# Altium project KB-PCB-R02.PrjPcb (part 2 of 2)

## Sheet backlight_RGB.SchDoc: Backlight RGB
size 594 x 420 mm; SheetNumber: 3; SheetTotal: 4; DocSize: DINA2
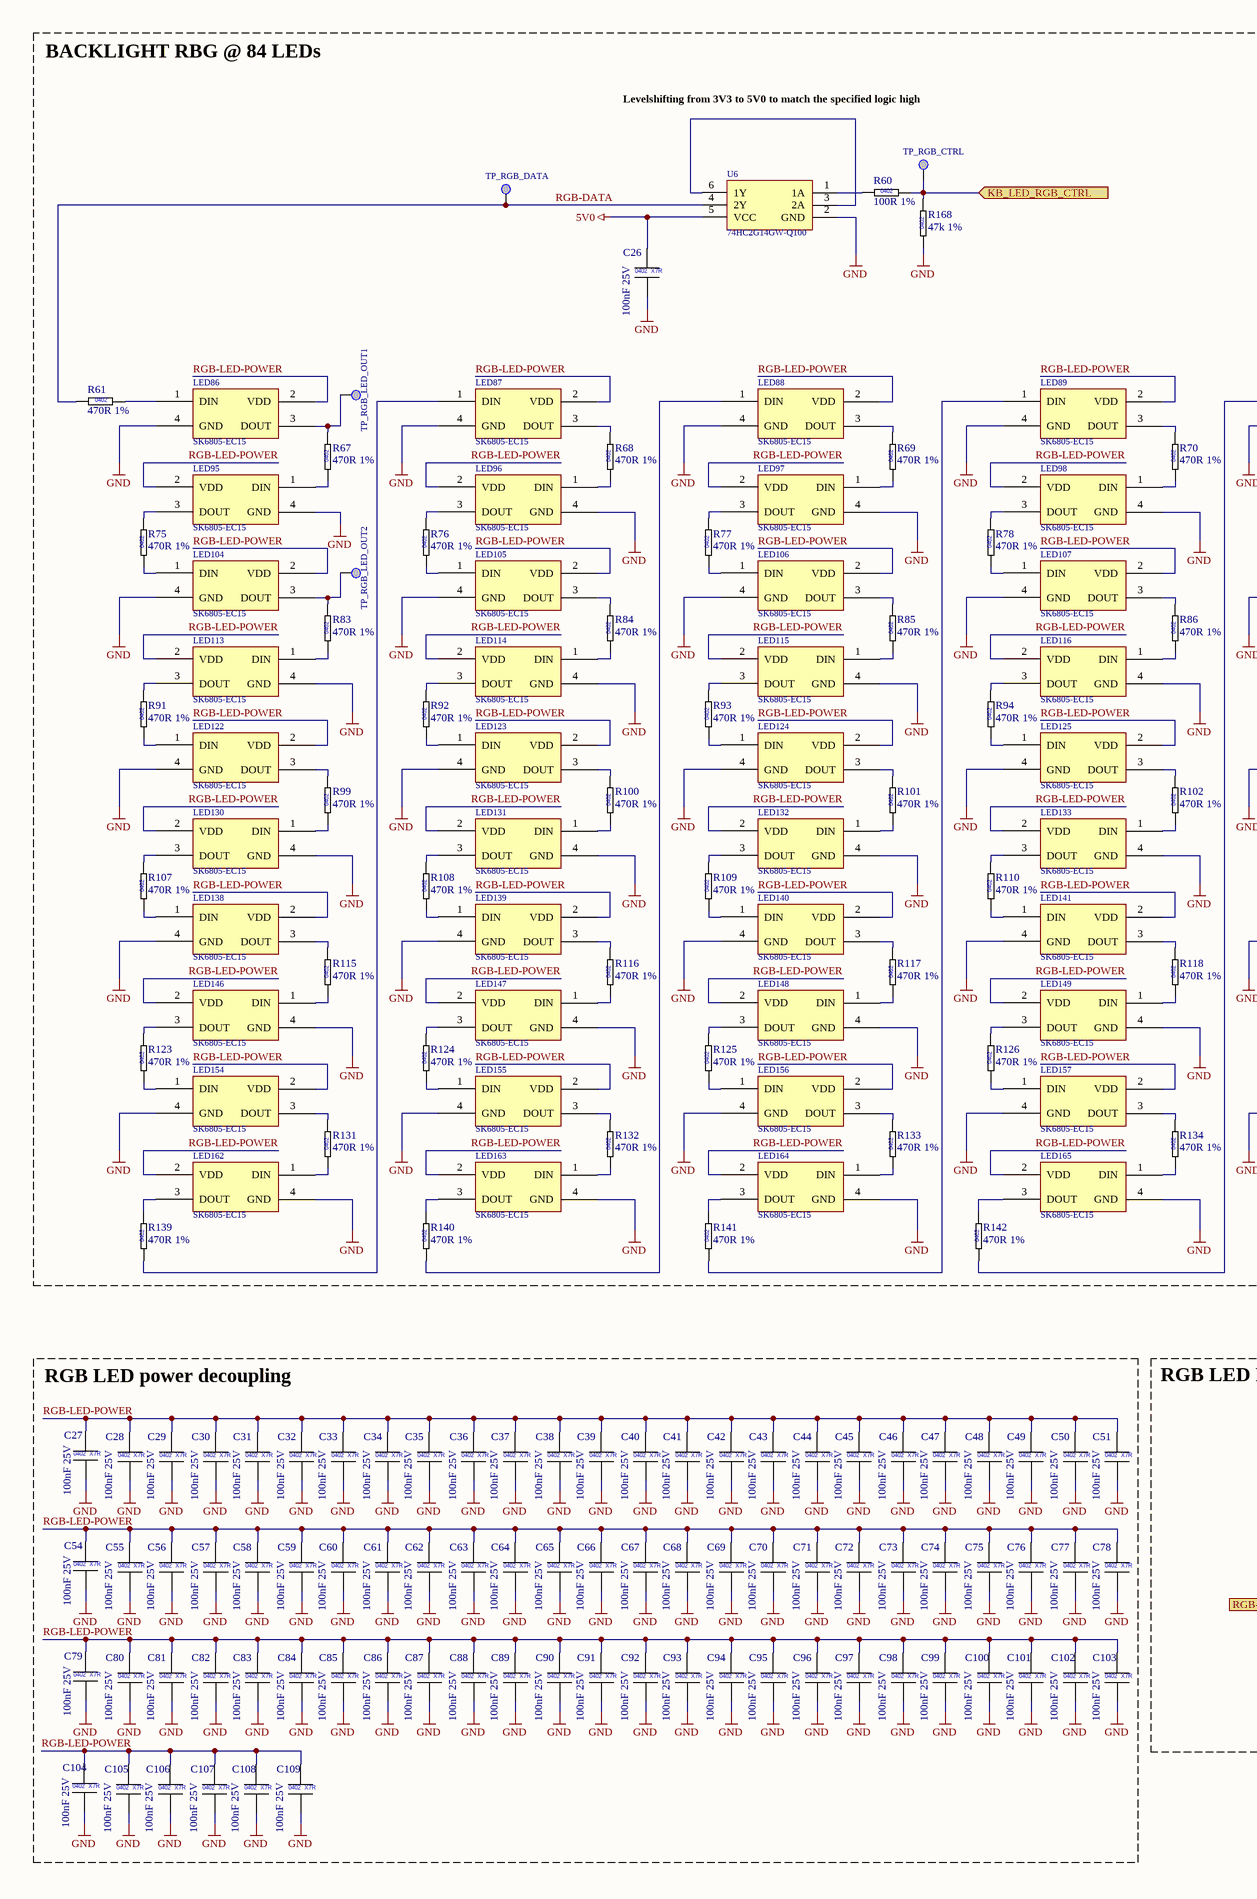
[diagram p5: backlight_RGB.SchDoc, left]
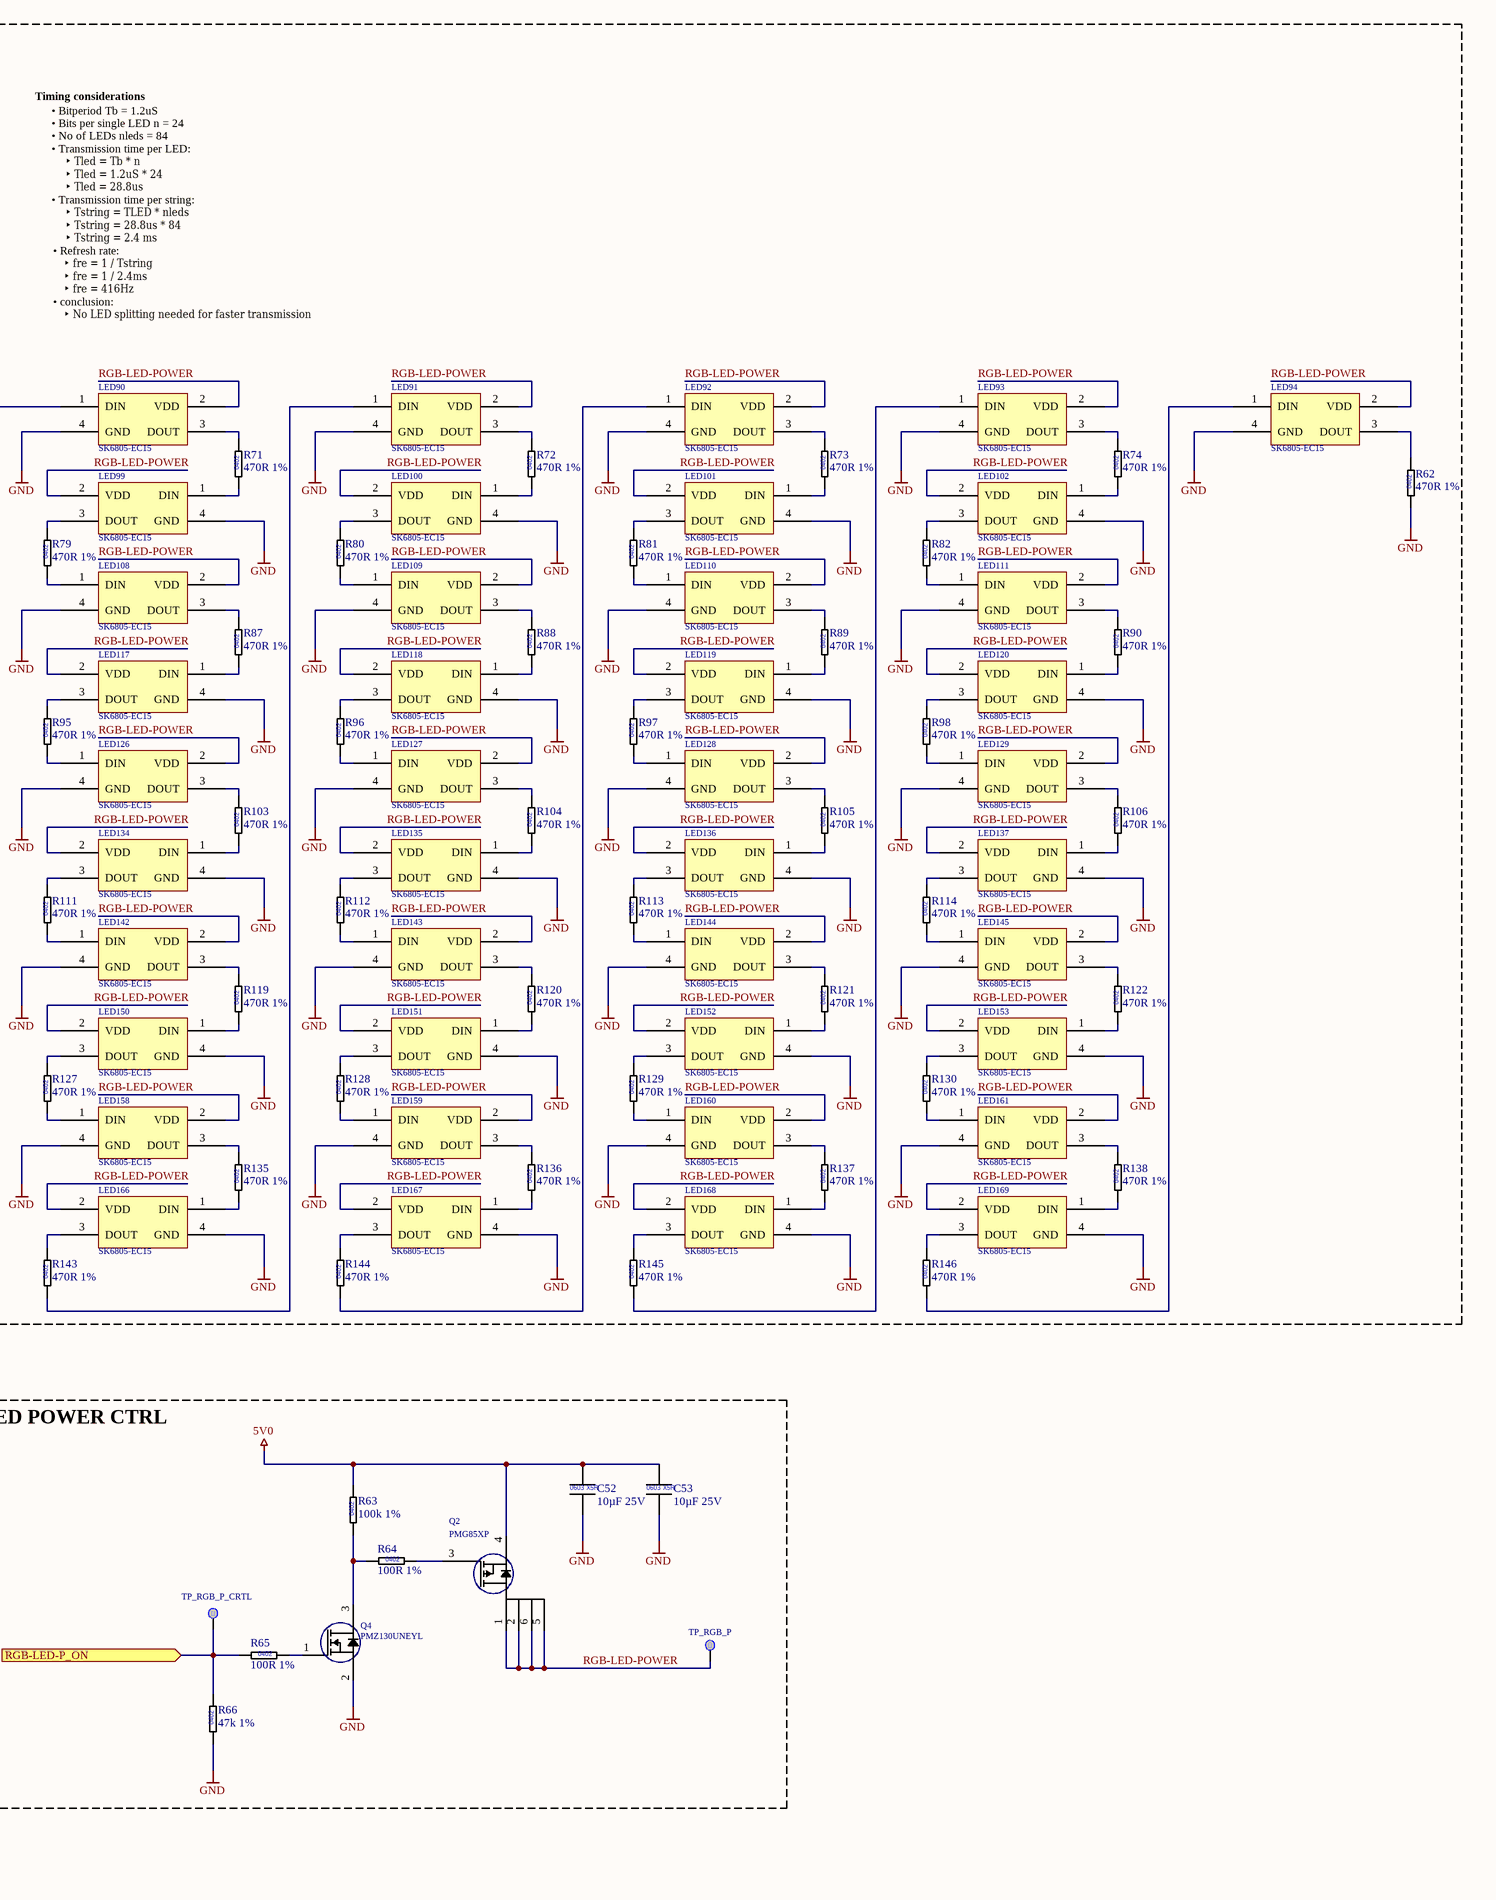
[diagram p6: backlight_RGB.SchDoc, right]

### Parts
(Parts that share a designator on the sheet are numbered #1, #2 ... from top to bottom, then left to right.)
?#3  (no value)  (graphical)
C26  100nF 25V  [CAPC1005X06L]
C27  100nF 25V  [CAPC1005X06L]
C28  100nF 25V  [CAPC1005X06L]
C29  100nF 25V  [CAPC1005X06L]
C30  100nF 25V  [CAPC1005X06L]
C31  100nF 25V  [CAPC1005X06L]
C32  100nF 25V  [CAPC1005X06L]
C33  100nF 25V  [CAPC1005X06L]
C34  100nF 25V  [CAPC1005X06L]
C35  100nF 25V  [CAPC1005X06L]
C36  100nF 25V  [CAPC1005X06L]
C37  100nF 25V  [CAPC1005X06L]
C38  100nF 25V  [CAPC1005X06L]
C39  100nF 25V  [CAPC1005X06L]
C40  100nF 25V  [CAPC1005X06L]
C41  100nF 25V  [CAPC1005X06L]
C42  100nF 25V  [CAPC1005X06L]
C43  100nF 25V  [CAPC1005X06L]
C44  100nF 25V  [CAPC1005X06L]
C45  100nF 25V  [CAPC1005X06L]
C46  100nF 25V  [CAPC1005X06L]
C47  100nF 25V  [CAPC1005X06L]
C48  100nF 25V  [CAPC1005X06L]
C49  100nF 25V  [CAPC1005X06L]
C50  100nF 25V  [CAPC1005X06L]
C51  100nF 25V  [CAPC1005X06L]
C52  10µF 25V  [CAPC1608X10L]
C53  10µF 25V  [CAPC1608X10L]
C54  100nF 25V  [CAPC1005X06L]
C55  100nF 25V  [CAPC1005X06L]
C56  100nF 25V  [CAPC1005X06L]
C57  100nF 25V  [CAPC1005X06L]
C58  100nF 25V  [CAPC1005X06L]
C59  100nF 25V  [CAPC1005X06L]
C60  100nF 25V  [CAPC1005X06L]
C61  100nF 25V  [CAPC1005X06L]
C62  100nF 25V  [CAPC1005X06L]
C63  100nF 25V  [CAPC1005X06L]
C64  100nF 25V  [CAPC1005X06L]
C65  100nF 25V  [CAPC1005X06L]
C66  100nF 25V  [CAPC1005X06L]
C67  100nF 25V  [CAPC1005X06L]
C68  100nF 25V  [CAPC1005X06L]
C69  100nF 25V  [CAPC1005X06L]
C70  100nF 25V  [CAPC1005X06L]
C71  100nF 25V  [CAPC1005X06L]
C72  100nF 25V  [CAPC1005X06L]
C73  100nF 25V  [CAPC1005X06L]
C74  100nF 25V  [CAPC1005X06L]
C75  100nF 25V  [CAPC1005X06L]
C76  100nF 25V  [CAPC1005X06L]
C77  100nF 25V  [CAPC1005X06L]
C78  100nF 25V  [CAPC1005X06L]
C79  100nF 25V  [CAPC1005X06L]
C80  100nF 25V  [CAPC1005X06L]
C81  100nF 25V  [CAPC1005X06L]
C82  100nF 25V  [CAPC1005X06L]
C83  100nF 25V  [CAPC1005X06L]
C84  100nF 25V  [CAPC1005X06L]
C85  100nF 25V  [CAPC1005X06L]
C86  100nF 25V  [CAPC1005X06L]
C87  100nF 25V  [CAPC1005X06L]
C88  100nF 25V  [CAPC1005X06L]
C89  100nF 25V  [CAPC1005X06L]
C90  100nF 25V  [CAPC1005X06L]
C91  100nF 25V  [CAPC1005X06L]
C92  100nF 25V  [CAPC1005X06L]
C93  100nF 25V  [CAPC1005X06L]
C94  100nF 25V  [CAPC1005X06L]
C95  100nF 25V  [CAPC1005X06L]
C96  100nF 25V  [CAPC1005X06L]
C97  100nF 25V  [CAPC1005X06L]
C98  100nF 25V  [CAPC1005X06L]
C99  100nF 25V  [CAPC1005X06L]
C100  100nF 25V  [CAPC1005X06L]
C101  100nF 25V  [CAPC1005X06L]
C102  100nF 25V  [CAPC1005X06L]
C103  100nF 25V  [CAPC1005X06L]
C104  100nF 25V  [CAPC1005X06L]
C105  100nF 25V  [CAPC1005X06L]
C106  100nF 25V  [CAPC1005X06L]
C107  100nF 25V  [CAPC1005X06L]
C108  100nF 25V  [CAPC1005X06L]
C109  100nF 25V  [CAPC1005X06L]
LED86  SK6805-EC15  [LED 0606 RGB SK6805-EC15]
LED87  SK6805-EC15  [LED 0606 RGB SK6805-EC15]
LED88  SK6805-EC15  [LED 0606 RGB SK6805-EC15]
LED89  SK6805-EC15  [LED 0606 RGB SK6805-EC15]
LED90  SK6805-EC15  [LED 0606 RGB SK6805-EC15]
LED91  SK6805-EC15  [LED 0606 RGB SK6805-EC15]
LED92  SK6805-EC15  [LED 0606 RGB SK6805-EC15]
LED93  SK6805-EC15  [LED 0606 RGB SK6805-EC15]
LED94  SK6805-EC15  [LED 0606 RGB SK6805-EC15]
LED95  SK6805-EC15  [LED 0606 RGB SK6805-EC15]
LED96  SK6805-EC15  [LED 0606 RGB SK6805-EC15]
LED97  SK6805-EC15  [LED 0606 RGB SK6805-EC15]
LED98  SK6805-EC15  [LED 0606 RGB SK6805-EC15]
LED99  SK6805-EC15  [LED 0606 RGB SK6805-EC15]
LED100  SK6805-EC15  [LED 0606 RGB SK6805-EC15]
LED101  SK6805-EC15  [LED 0606 RGB SK6805-EC15]
LED102  SK6805-EC15  [LED 0606 RGB SK6805-EC15]
LED104  SK6805-EC15  [LED 0606 RGB SK6805-EC15]
LED105  SK6805-EC15  [LED 0606 RGB SK6805-EC15]
LED106  SK6805-EC15  [LED 0606 RGB SK6805-EC15]
LED107  SK6805-EC15  [LED 0606 RGB SK6805-EC15]
LED108  SK6805-EC15  [LED 0606 RGB SK6805-EC15]
LED109  SK6805-EC15  [LED 0606 RGB SK6805-EC15]
LED110  SK6805-EC15  [LED 0606 RGB SK6805-EC15]
LED111  SK6805-EC15  [LED 0606 RGB SK6805-EC15]
LED113  SK6805-EC15  [LED 0606 RGB SK6805-EC15]
LED114  SK6805-EC15  [LED 0606 RGB SK6805-EC15]
LED115  SK6805-EC15  [LED 0606 RGB SK6805-EC15]
LED116  SK6805-EC15  [LED 0606 RGB SK6805-EC15]
LED117  SK6805-EC15  [LED 0606 RGB SK6805-EC15]
LED118  SK6805-EC15  [LED 0606 RGB SK6805-EC15]
LED119  SK6805-EC15  [LED 0606 RGB SK6805-EC15]
LED120  SK6805-EC15  [LED 0606 RGB SK6805-EC15]
LED122  SK6805-EC15  [LED 0606 RGB SK6805-EC15]
LED123  SK6805-EC15  [LED 0606 RGB SK6805-EC15]
LED124  SK6805-EC15  [LED 0606 RGB SK6805-EC15]
LED125  SK6805-EC15  [LED 0606 RGB SK6805-EC15]
LED126  SK6805-EC15  [LED 0606 RGB SK6805-EC15]
LED127  SK6805-EC15  [LED 0606 RGB SK6805-EC15]
LED128  SK6805-EC15  [LED 0606 RGB SK6805-EC15]
LED129  SK6805-EC15  [LED 0606 RGB SK6805-EC15]
LED130  SK6805-EC15  [LED 0606 RGB SK6805-EC15]
LED131  SK6805-EC15  [LED 0606 RGB SK6805-EC15]
LED132  SK6805-EC15  [LED 0606 RGB SK6805-EC15]
LED133  SK6805-EC15  [LED 0606 RGB SK6805-EC15]
LED134  SK6805-EC15  [LED 0606 RGB SK6805-EC15]
LED135  SK6805-EC15  [LED 0606 RGB SK6805-EC15]
LED136  SK6805-EC15  [LED 0606 RGB SK6805-EC15]
LED137  SK6805-EC15  [LED 0606 RGB SK6805-EC15]
LED138  SK6805-EC15  [LED 0606 RGB SK6805-EC15]
LED139  SK6805-EC15  [LED 0606 RGB SK6805-EC15]
LED140  SK6805-EC15  [LED 0606 RGB SK6805-EC15]
LED141  SK6805-EC15  [LED 0606 RGB SK6805-EC15]
LED142  SK6805-EC15  [LED 0606 RGB SK6805-EC15]
LED143  SK6805-EC15  [LED 0606 RGB SK6805-EC15]
LED144  SK6805-EC15  [LED 0606 RGB SK6805-EC15]
LED145  SK6805-EC15  [LED 0606 RGB SK6805-EC15]
LED146  SK6805-EC15  [LED 0606 RGB SK6805-EC15]
LED147  SK6805-EC15  [LED 0606 RGB SK6805-EC15]
LED148  SK6805-EC15  [LED 0606 RGB SK6805-EC15]
LED149  SK6805-EC15  [LED 0606 RGB SK6805-EC15]
LED150  SK6805-EC15  [LED 0606 RGB SK6805-EC15]
LED151  SK6805-EC15  [LED 0606 RGB SK6805-EC15]
LED152  SK6805-EC15  [LED 0606 RGB SK6805-EC15]
LED153  SK6805-EC15  [LED 0606 RGB SK6805-EC15]
LED154  SK6805-EC15  [LED 0606 RGB SK6805-EC15]
LED155  SK6805-EC15  [LED 0606 RGB SK6805-EC15]
LED156  SK6805-EC15  [LED 0606 RGB SK6805-EC15]
LED157  SK6805-EC15  [LED 0606 RGB SK6805-EC15]
LED158  SK6805-EC15  [LED 0606 RGB SK6805-EC15]
LED159  SK6805-EC15  [LED 0606 RGB SK6805-EC15]
LED160  SK6805-EC15  [LED 0606 RGB SK6805-EC15]
LED161  SK6805-EC15  [LED 0606 RGB SK6805-EC15]
LED162  SK6805-EC15  [LED 0606 RGB SK6805-EC15]
LED163  SK6805-EC15  [LED 0606 RGB SK6805-EC15]
LED164  SK6805-EC15  [LED 0606 RGB SK6805-EC15]
LED165  SK6805-EC15  [LED 0606 RGB SK6805-EC15]
LED166  SK6805-EC15  [LED 0606 RGB SK6805-EC15]
LED167  SK6805-EC15  [LED 0606 RGB SK6805-EC15]
LED168  SK6805-EC15  [LED 0606 RGB SK6805-EC15]
LED169  SK6805-EC15  [LED 0606 RGB SK6805-EC15]
Q2  PMG85XP  [TSOP65P210X110-6N]
Q4  PMZ130UNEYL  [DFN65P98X50-3N]
R60  100R 1%  [RESC1005X04L]
R61  470R 1%  [RESC1005X04L]
R62  470R 1%  [RESC1005X04L]
R63  100k 1%  [RESC1005X04L]
R64  100R 1%  [RESC1005X04L]
R65  100R 1%  [RESC1005X04L]
R66  47k 1%  [RESC1005X04L]
R67  470R 1%  [RESC1005X04L]
R68  470R 1%  [RESC1005X04L]
R69  470R 1%  [RESC1005X04L]
R70  470R 1%  [RESC1005X04L]
R71  470R 1%  [RESC1005X04L]
R72  470R 1%  [RESC1005X04L]
R73  470R 1%  [RESC1005X04L]
R74  470R 1%  [RESC1005X04L]
R75  470R 1%  [RESC1005X04L]
R76  470R 1%  [RESC1005X04L]
R77  470R 1%  [RESC1005X04L]
R78  470R 1%  [RESC1005X04L]
R79  470R 1%  [RESC1005X04L]
R80  470R 1%  [RESC1005X04L]
R81  470R 1%  [RESC1005X04L]
R82  470R 1%  [RESC1005X04L]
R83  470R 1%  [RESC1005X04L]
R84  470R 1%  [RESC1005X04L]
R85  470R 1%  [RESC1005X04L]
R86  470R 1%  [RESC1005X04L]
R87  470R 1%  [RESC1005X04L]
R88  470R 1%  [RESC1005X04L]
R89  470R 1%  [RESC1005X04L]
R90  470R 1%  [RESC1005X04L]
R91  470R 1%  [RESC1005X04L]
R92  470R 1%  [RESC1005X04L]
R93  470R 1%  [RESC1005X04L]
R94  470R 1%  [RESC1005X04L]
R95  470R 1%  [RESC1005X04L]
R96  470R 1%  [RESC1005X04L]
R97  470R 1%  [RESC1005X04L]
R98  470R 1%  [RESC1005X04L]
R99  470R 1%  [RESC1005X04L]
R100  470R 1%  [RESC1005X04L]
R101  470R 1%  [RESC1005X04L]
R102  470R 1%  [RESC1005X04L]
R103  470R 1%  [RESC1005X04L]
R104  470R 1%  [RESC1005X04L]
R105  470R 1%  [RESC1005X04L]
R106  470R 1%  [RESC1005X04L]
R107  470R 1%  [RESC1005X04L]
R108  470R 1%  [RESC1005X04L]
R109  470R 1%  [RESC1005X04L]
R110  470R 1%  [RESC1005X04L]
R111  470R 1%  [RESC1005X04L]
R112  470R 1%  [RESC1005X04L]
R113  470R 1%  [RESC1005X04L]
R114  470R 1%  [RESC1005X04L]
R115  470R 1%  [RESC1005X04L]
R116  470R 1%  [RESC1005X04L]
R117  470R 1%  [RESC1005X04L]
R118  470R 1%  [RESC1005X04L]
R119  470R 1%  [RESC1005X04L]
R120  470R 1%  [RESC1005X04L]
R121  470R 1%  [RESC1005X04L]
R122  470R 1%  [RESC1005X04L]
R123  470R 1%  [RESC1005X04L]
R124  470R 1%  [RESC1005X04L]
R125  470R 1%  [RESC1005X04L]
R126  470R 1%  [RESC1005X04L]
R127  470R 1%  [RESC1005X04L]
R128  470R 1%  [RESC1005X04L]
R129  470R 1%  [RESC1005X04L]
R130  470R 1%  [RESC1005X04L]
R131  470R 1%  [RESC1005X04L]
R132  470R 1%  [RESC1005X04L]
R133  470R 1%  [RESC1005X04L]
R134  470R 1%  [RESC1005X04L]
R135  470R 1%  [RESC1005X04L]
R136  470R 1%  [RESC1005X04L]
R137  470R 1%  [RESC1005X04L]
R138  470R 1%  [RESC1005X04L]
R139  470R 1%  [RESC1005X04L]
R140  470R 1%  [RESC1005X04L]
R141  470R 1%  [RESC1005X04L]
R142  470R 1%  [RESC1005X04L]
R143  470R 1%  [RESC1005X04L]
R144  470R 1%  [RESC1005X04L]
R145  470R 1%  [RESC1005X04L]
R146  470R 1%  [RESC1005X04L]
R168  47k 1%  [RESC1005X04L]
TP_RGB_CTRL  Testpoint 0.5mm  [TP_0.50mm]  (value not drawn)  (no BOM)
TP_RGB_DATA  Testpoint 0.75mm  [TP_0.75mm]  (value not drawn)  (no BOM)
TP_RGB_LED_OUT1  Testpoint 0.5mm  [TP_0.50mm]  (value not drawn)  (no BOM)
TP_RGB_LED_OUT2  Testpoint 0.5mm  [TP_0.50mm]  (value not drawn)  (no BOM)
TP_RGB_P  Testpoint 0.75mm  [TP_0.75mm]  (value not drawn)  (no BOM)
TP_RGB_P_CRTL  Testpoint 0.75mm  [TP_0.75mm]  (value not drawn)  (no BOM)
U6  74HC2G14GW-Q100  [TSOP65P210X110-6N]

### Blocks framed on the sheet
BACKLIGHT RBG @ 84 LEDs: C26 LED86-LED102 LED104-LED111 LED113-LED120 LED122-LED169 R60-R62 R67-R146 R168 TP_RGB_CTRL TP_RGB_DATA TP_RGB_LED_OUT1 TP_RGB_LED_OUT2 U6
RGB LED power decoupling: C27-C51 C54-C109
RGB LED POWER CTRL: C52 C53 Q2 Q4 R63-R66 TP_RGB_P TP_RGB_P_CRTL

### Ports
KB_LED_RGB_CTRL (in), RGB-LED-P_ON (in)

### Nets
5V0: C26.1 C52.1 C53.1 Q2.4(S) R63.2 U6.5(VCC)
GND: C26.2 C27.2 C28.2 C29.2 C30.2 C31.2 C32.2 C33.2 C34.2 C35.2 C36.2 C37.2 C38.2 C39.2 C40.2 C41.2 C42.2 C43.2 C44.2 C45.2 C46.2 C47.2 C48.2 C49.2 C50.2 C51.2 C52.2 C53.2 C54.2 C55.2 C56.2 C57.2 C58.2 C59.2 C60.2 C61.2 C62.2 C63.2 C64.2 C65.2 C66.2 C67.2 C68.2 C69.2 C70.2 C71.2 C72.2 C73.2 C74.2 C75.2 C76.2 C77.2 C78.2 C79.2 C80.2 C81.2 C82.2 C83.2 C84.2 C85.2 C86.2 C87.2 C88.2 C89.2 C90.2 C91.2 C92.2 C93.2 C94.2 C95.2 C96.2 C97.2 C98.2 C99.2 C100.2 C101.2 C102.2 C103.2 C104.2 C105.2 C106.2 C107.2 C108.2 C109.2 LED86.4(GND) LED87.4(GND) LED88.4(GND) LED89.4(GND) LED90.4(GND) LED91.4(GND) LED92.4(GND) LED93.4(GND) LED94.4(GND) LED95.4(GND) LED96.4(GND) LED97.4(GND) LED98.4(GND) LED99.4(GND) LED100.4(GND) LED101.4(GND) LED102.4(GND) LED104.4(GND) LED105.4(GND) LED106.4(GND) LED107.4(GND) LED108.4(GND) LED109.4(GND) LED110.4(GND) LED111.4(GND) LED113.4(GND) LED114.4(GND) LED115.4(GND) LED116.4(GND) LED117.4(GND) LED118.4(GND) LED119.4(GND) LED120.4(GND) LED122.4(GND) LED123.4(GND) LED124.4(GND) LED125.4(GND) LED126.4(GND) LED127.4(GND) LED128.4(GND) LED129.4(GND) LED130.4(GND) LED131.4(GND) LED132.4(GND) LED133.4(GND) LED134.4(GND) LED135.4(GND) LED136.4(GND) LED137.4(GND) LED138.4(GND) LED139.4(GND) LED140.4(GND) LED141.4(GND) LED142.4(GND) LED143.4(GND) LED144.4(GND) LED145.4(GND) LED146.4(GND) LED147.4(GND) LED148.4(GND) LED149.4(GND) LED150.4(GND) LED151.4(GND) LED152.4(GND) LED153.4(GND) LED154.4(GND) LED155.4(GND) LED156.4(GND) LED157.4(GND) LED158.4(GND) LED159.4(GND) LED160.4(GND) LED161.4(GND) LED162.4(GND) LED163.4(GND) LED164.4(GND) LED165.4(GND) LED166.4(GND) LED167.4(GND) LED168.4(GND) LED169.4(GND) Q4.2(S) R62.1 R66.1 R168.1 U6.2(GND)
RGB-DATA: R61.1 TP_RGB_DATA.TP U6.4(2Y)
RGB-LED-POWER: C27.1 C28.1 C29.1 C30.1 C31.1 C32.1 C33.1 C34.1 C35.1 C36.1 C37.1 C38.1 C39.1 C40.1 C41.1 C42.1 C43.1 C44.1 C45.1 C46.1 C47.1 C48.1 C49.1 C50.1 C51.1 C54.1 C55.1 C56.1 C57.1 C58.1 C59.1 C60.1 C61.1 C62.1 C63.1 C64.1 C65.1 C66.1 C67.1 C68.1 C69.1 C70.1 C71.1 C72.1 C73.1 C74.1 C75.1 C76.1 C77.1 C78.1 C79.1 C80.1 C81.1 C82.1 C83.1 C84.1 C85.1 C86.1 C87.1 C88.1 C89.1 C90.1 C91.1 C92.1 C93.1 C94.1 C95.1 C96.1 C97.1 C98.1 C99.1 C100.1 C101.1 C102.1 C103.1 C104.1 C105.1 C106.1 C107.1 C108.1 C109.1 LED86.2(VDD) LED87.2(VDD) LED88.2(VDD) LED89.2(VDD) LED90.2(VDD) LED91.2(VDD) LED92.2(VDD) LED93.2(VDD) LED94.2(VDD) LED95.2(VDD) LED96.2(VDD) LED97.2(VDD) LED98.2(VDD) LED99.2(VDD) LED100.2(VDD) LED101.2(VDD) LED102.2(VDD) LED104.2(VDD) LED105.2(VDD) LED106.2(VDD) LED107.2(VDD) LED108.2(VDD) LED109.2(VDD) LED110.2(VDD) LED111.2(VDD) LED113.2(VDD) LED114.2(VDD) LED115.2(VDD) LED116.2(VDD) LED117.2(VDD) LED118.2(VDD) LED119.2(VDD) LED120.2(VDD) LED122.2(VDD) LED123.2(VDD) LED124.2(VDD) LED125.2(VDD) LED126.2(VDD) LED127.2(VDD) LED128.2(VDD) LED129.2(VDD) LED130.2(VDD) LED131.2(VDD) LED132.2(VDD) LED133.2(VDD) LED134.2(VDD) LED135.2(VDD) LED136.2(VDD) LED137.2(VDD) LED138.2(VDD) LED139.2(VDD) LED140.2(VDD) LED141.2(VDD) LED142.2(VDD) LED143.2(VDD) LED144.2(VDD) LED145.2(VDD) LED146.2(VDD) LED147.2(VDD) LED148.2(VDD) LED149.2(VDD) LED150.2(VDD) LED151.2(VDD) LED152.2(VDD) LED153.2(VDD) LED154.2(VDD) LED155.2(VDD) LED156.2(VDD) LED157.2(VDD) LED158.2(VDD) LED159.2(VDD) LED160.2(VDD) LED161.2(VDD) LED162.2(VDD) LED163.2(VDD) LED164.2(VDD) LED165.2(VDD) LED166.2(VDD) LED167.2(VDD) LED168.2(VDD) LED169.2(VDD) Q2.1(D) Q2.2(D) Q2.5(D) Q2.6(D) TP_RGB_P.TP
NetLED86_1: LED86.1(DIN) R61.2
NetLED86_3: LED86.3(DOUT) R67.2 TP_RGB_LED_OUT1.TP
NetLED87_1: LED87.1(DIN) R139.1
NetLED87_3: LED87.3(DOUT) R68.2
NetLED88_1: LED88.1(DIN) R140.1
NetLED88_3: LED88.3(DOUT) R69.2
NetLED89_1: LED89.1(DIN) R141.1
NetLED89_3: LED89.3(DOUT) R70.2
NetLED90_1: LED90.1(DIN) R142.1
NetLED90_3: LED90.3(DOUT) R71.2
NetLED91_1: LED91.1(DIN) R143.1
NetLED91_3: LED91.3(DOUT) R72.2
NetLED92_1: LED92.1(DIN) R144.1
NetLED92_3: LED92.3(DOUT) R73.2
NetLED93_1: LED93.1(DIN) R145.1
NetLED93_3: LED93.3(DOUT) R74.2
NetLED94_1: LED94.1(DIN) R146.1
NetLED94_3: LED94.3(DOUT) R62.2
NetLED95_1: LED95.1(DIN) R67.1
NetLED95_3: LED95.3(DOUT) R75.2
NetLED96_1: LED96.1(DIN) R68.1
NetLED96_3: LED96.3(DOUT) R76.2
NetLED97_1: LED97.1(DIN) R69.1
NetLED97_3: LED97.3(DOUT) R77.2
NetLED98_1: LED98.1(DIN) R70.1
NetLED98_3: LED98.3(DOUT) R78.2
NetLED99_1: LED99.1(DIN) R71.1
NetLED99_3: LED99.3(DOUT) R79.2
NetLED100_1: LED100.1(DIN) R72.1
NetLED100_3: LED100.3(DOUT) R80.2
NetLED101_1: LED101.1(DIN) R73.1
NetLED101_3: LED101.3(DOUT) R81.2
NetLED102_1: LED102.1(DIN) R74.1
NetLED102_3: LED102.3(DOUT) R82.2
NetLED104_1: LED104.1(DIN) R75.1
NetLED104_3: LED104.3(DOUT) R83.2 TP_RGB_LED_OUT2.TP
NetLED105_1: LED105.1(DIN) R76.1
NetLED105_3: LED105.3(DOUT) R84.2
NetLED106_1: LED106.1(DIN) R77.1
NetLED106_3: LED106.3(DOUT) R85.2
NetLED107_1: LED107.1(DIN) R78.1
NetLED107_3: LED107.3(DOUT) R86.2
NetLED108_1: LED108.1(DIN) R79.1
NetLED108_3: LED108.3(DOUT) R87.2
NetLED109_1: LED109.1(DIN) R80.1
NetLED109_3: LED109.3(DOUT) R88.2
NetLED110_1: LED110.1(DIN) R81.1
NetLED110_3: LED110.3(DOUT) R89.2
NetLED111_1: LED111.1(DIN) R82.1
NetLED111_3: LED111.3(DOUT) R90.2
NetLED113_1: LED113.1(DIN) R83.1
NetLED113_3: LED113.3(DOUT) R91.2
NetLED114_1: LED114.1(DIN) R84.1
NetLED114_3: LED114.3(DOUT) R92.2
NetLED115_1: LED115.1(DIN) R85.1
NetLED115_3: LED115.3(DOUT) R93.2
NetLED116_1: LED116.1(DIN) R86.1
NetLED116_3: LED116.3(DOUT) R94.2
NetLED117_1: LED117.1(DIN) R87.1
NetLED117_3: LED117.3(DOUT) R95.2
NetLED118_1: LED118.1(DIN) R88.1
NetLED118_3: LED118.3(DOUT) R96.2
NetLED119_1: LED119.1(DIN) R89.1
NetLED119_3: LED119.3(DOUT) R97.2
NetLED120_1: LED120.1(DIN) R90.1
NetLED120_3: LED120.3(DOUT) R98.2
NetLED122_1: LED122.1(DIN) R91.1
NetLED122_3: LED122.3(DOUT) R99.2
NetLED123_1: LED123.1(DIN) R92.1
NetLED123_3: LED123.3(DOUT) R100.2
NetLED124_1: LED124.1(DIN) R93.1
NetLED124_3: LED124.3(DOUT) R101.2
NetLED125_1: LED125.1(DIN) R94.1
NetLED125_3: LED125.3(DOUT) R102.2
NetLED126_1: LED126.1(DIN) R95.1
NetLED126_3: LED126.3(DOUT) R103.2
NetLED127_1: LED127.1(DIN) R96.1
NetLED127_3: LED127.3(DOUT) R104.2
NetLED128_1: LED128.1(DIN) R97.1
NetLED128_3: LED128.3(DOUT) R105.2
NetLED129_1: LED129.1(DIN) R98.1
NetLED129_3: LED129.3(DOUT) R106.2
NetLED130_1: LED130.1(DIN) R99.1
NetLED130_3: LED130.3(DOUT) R107.2
NetLED131_1: LED131.1(DIN) R100.1
NetLED131_3: LED131.3(DOUT) R108.2
NetLED132_1: LED132.1(DIN) R101.1
NetLED132_3: LED132.3(DOUT) R109.2
NetLED133_1: LED133.1(DIN) R102.1
NetLED133_3: LED133.3(DOUT) R110.2
NetLED134_1: LED134.1(DIN) R103.1
NetLED134_3: LED134.3(DOUT) R111.2
NetLED135_1: LED135.1(DIN) R104.1
NetLED135_3: LED135.3(DOUT) R112.2
NetLED136_1: LED136.1(DIN) R105.1
NetLED136_3: LED136.3(DOUT) R113.2
NetLED137_1: LED137.1(DIN) R106.1
NetLED137_3: LED137.3(DOUT) R114.2
NetLED138_1: LED138.1(DIN) R107.1
NetLED138_3: LED138.3(DOUT) R115.2
NetLED139_1: LED139.1(DIN) R108.1
NetLED139_3: LED139.3(DOUT) R116.2
NetLED140_1: LED140.1(DIN) R109.1
NetLED140_3: LED140.3(DOUT) R117.2
NetLED141_1: LED141.1(DIN) R110.1
NetLED141_3: LED141.3(DOUT) R118.2
NetLED142_1: LED142.1(DIN) R111.1
NetLED142_3: LED142.3(DOUT) R119.2
NetLED143_1: LED143.1(DIN) R112.1
NetLED143_3: LED143.3(DOUT) R120.2
NetLED144_1: LED144.1(DIN) R113.1
NetLED144_3: LED144.3(DOUT) R121.2
NetLED145_1: LED145.1(DIN) R114.1
NetLED145_3: LED145.3(DOUT) R122.2
NetLED146_1: LED146.1(DIN) R115.1
NetLED146_3: LED146.3(DOUT) R123.2
NetLED147_1: LED147.1(DIN) R116.1
NetLED147_3: LED147.3(DOUT) R124.2
NetLED148_1: LED148.1(DIN) R117.1
NetLED148_3: LED148.3(DOUT) R125.2
NetLED149_1: LED149.1(DIN) R118.1
NetLED149_3: LED149.3(DOUT) R126.2
NetLED150_1: LED150.1(DIN) R119.1
NetLED150_3: LED150.3(DOUT) R127.2
NetLED151_1: LED151.1(DIN) R120.1
NetLED151_3: LED151.3(DOUT) R128.2
NetLED152_1: LED152.1(DIN) R121.1
NetLED152_3: LED152.3(DOUT) R129.2
NetLED153_1: LED153.1(DIN) R122.1
NetLED153_3: LED153.3(DOUT) R130.2
NetLED154_1: LED154.1(DIN) R123.1
NetLED154_3: LED154.3(DOUT) R131.2
NetLED155_1: LED155.1(DIN) R124.1
NetLED155_3: LED155.3(DOUT) R132.2
NetLED156_1: LED156.1(DIN) R125.1
NetLED156_3: LED156.3(DOUT) R133.2
NetLED157_1: LED157.1(DIN) R126.1
NetLED157_3: LED157.3(DOUT) R134.2
NetLED158_1: LED158.1(DIN) R127.1
NetLED158_3: LED158.3(DOUT) R135.2
NetLED159_1: LED159.1(DIN) R128.1
NetLED159_3: LED159.3(DOUT) R136.2
NetLED160_1: LED160.1(DIN) R129.1
NetLED160_3: LED160.3(DOUT) R137.2
NetLED161_1: LED161.1(DIN) R130.1
NetLED161_3: LED161.3(DOUT) R138.2
NetLED162_1: LED162.1(DIN) R131.1
NetLED162_3: LED162.3(DOUT) R139.2
NetLED163_1: LED163.1(DIN) R132.1
NetLED163_3: LED163.3(DOUT) R140.2
NetLED164_1: LED164.1(DIN) R133.1
NetLED164_3: LED164.3(DOUT) R141.2
NetLED165_1: LED165.1(DIN) R134.1
NetLED165_3: LED165.3(DOUT) R142.2
NetLED166_1: LED166.1(DIN) R135.1
NetLED166_3: LED166.3(DOUT) R143.2
NetLED167_1: LED167.1(DIN) R136.1
NetLED167_3: LED167.3(DOUT) R144.2
NetLED168_1: LED168.1(DIN) R137.1
NetLED168_3: LED168.3(DOUT) R145.2
NetLED169_1: LED169.1(DIN) R138.1
NetLED169_3: LED169.3(DOUT) R146.2
NetQ2_3: Q2.3(G) R64.2
NetQ4_1: Q4.1(G) R65.2
NetQ4_3: Q4.3(D) R63.1 R64.1
NetR60_1: R60.1 U6.1(1A)
NetR60_2: R60.2 R168.2 TP_RGB_CTRL.TP ; port KB_LED_RGB_CTRL
NetR65_1: R65.1 R66.2 TP_RGB_P_CRTL.TP ; port RGB-LED-P_ON
NetU6_3: U6.3(2A) U6.6(1Y)

### Notes on the sheet
- Levelshifting from 3V3 to 5V0 to match the specified logic high
- Timing considerations
- • Bitperiod Tb = 1.2uS
- • Bits per single LED n = 24
- • No of LEDs nleds = 84
- • Transmission time per LED:
- • Transmission time per string:
- ‣ Tled = Tb * n
- ‣ Tled = 1.2uS * 24
- ‣ Tled = 28.8us
- • Refresh rate:
- ‣ fre = 1 / Tstring
- ‣ Tstring = TLED * nleds
- ‣ Tstring = 28.8us * 84
- ‣ Tstring = 2.4 ms
- • conclusion:
- ‣ fre = 1 / 2.4ms
- ‣ fre = 416Hz
- ‣ No LED splitting needed for faster transmission
- © OV Tech GmbH - Open Visions Technology
- (in symbol CAP_0402_100nF_25V) 0402; X7R
- (in symbol CAP_0603_10µ_25V) 0603; X5R
- (in symbol RES_0402_47k_1%) 0402
- (in symbol RES_0402_100k_1%) 0402
- (in symbol RES_0402_100R_1%) 0402
- (in symbol RES_0402_470R_1%) 0402

### Library data of the parts
?#3 = Titleblock_01
C26-C51 C54-C109 = CAP_0402_100nF_25V: as C1 on sheet Input_MCU; Manufacturer 2: Taiyo Yuden
C52 C53 = CAP_0603_10µ_25V: Multilayer Ceramic Capacitors MLCC - SMD/SMT 0603 25VDC; Manufacturer 1: Murata Electronics; Manufacturer 1 Prt. Nr.: GRM188R61E106KA73J; Manufacturer 2 Prt. Nr.: CL10A106MA8NRNC; Manufacturer 2: Samsung Electro-Mechanics
LED86-LED102 LED104-LED111 LED113-LED120 LED122-LED169 = LED RGB SK6805-EC15: -40℃~+80℃ RGB 0606 Light Emitting Diodes (LED) ROHS; Manufacturer 1: OPSCO Optoelectronics; Manufacturer 1 Prt. Nr.: SK6805-EC15
Q2 = P-Channel MOSFET_PMG85XP: - 20 V, 2 A P-channel Trench MOSFET; Manufacturer 1: Nexperia; Manufacturer 1 Prt. Nr.: PMG85XP,115
Q4 = N-Channel MOSFET_PMZ130UNEYL: MOSFET PMZ130UNE/SOT883/XQFN3; Manufacturer 1: Nexperia; Manufacturer 1 Prt. Nr.: PMZ130UNEYL
R60 R64 R65 = RES_0402_100R_1%: Thick Film Resistors - SMD 100R 1%; Manufacturer 1: Vishay / Dale; Manufacturer 1 Prt. Nr.: CRCW0402100RFKEDC; Manufacturer 2 Prt. Nr.: RC0402FR-07100RL; Manufacturer 2: YAGEO
R61 R62 R67-R146 = RES_0402_470R_1%: Thick Film Resistors - SMD 470R 1%; Manufacturer 1: Vishay / Dale; Manufacturer 1 Prt. Nr.: CRCW0402470RFKED; Manufacturer 2 Prt. Nr.: RC0402FR-13470RL; Manufacturer 2: YAGEO
R63 = RES_0402_100k_1%: Thick Film Resistors - SMD 100k 1%; Manufacturer 1: Vishay / Dale; Manufacturer 1 Prt. Nr.: CRCW0402100KFKEDC; Manufacturer 2 Prt. Nr.: RC0402FR-07100KL; Manufacturer 2: YAGEO
R66 R168 = RES_0402_47k_1%: Thick Film Resistors - SMD 47k 1%; Manufacturer 1: Vishay / Dale; Manufacturer 1 Prt. Nr.: CRCW040247K0FKEDC; Manufacturer 2 Prt. Nr.: RT0402FRE0747KL; Manufacturer 2: YAGEO
U6 = Dual inverting Schmitt trigger 74HC2G14GW-Q100: Schmitt Trigger Inverter, 1I/P, 125Deg C Rohs Compliant: Yes |Nexperia 74HC2G14GW-Q100; Manufacturer 1: Nexperia; Manufacturer 1 Prt. Nr.: 74HC2G14GW-Q100

## Sheet backlight_W.SchDoc: Backlight W
size 594 x 420 mm; Author: T. Ludemann; SheetNumber: 4; SheetTotal: 4; DocSize: DINA2
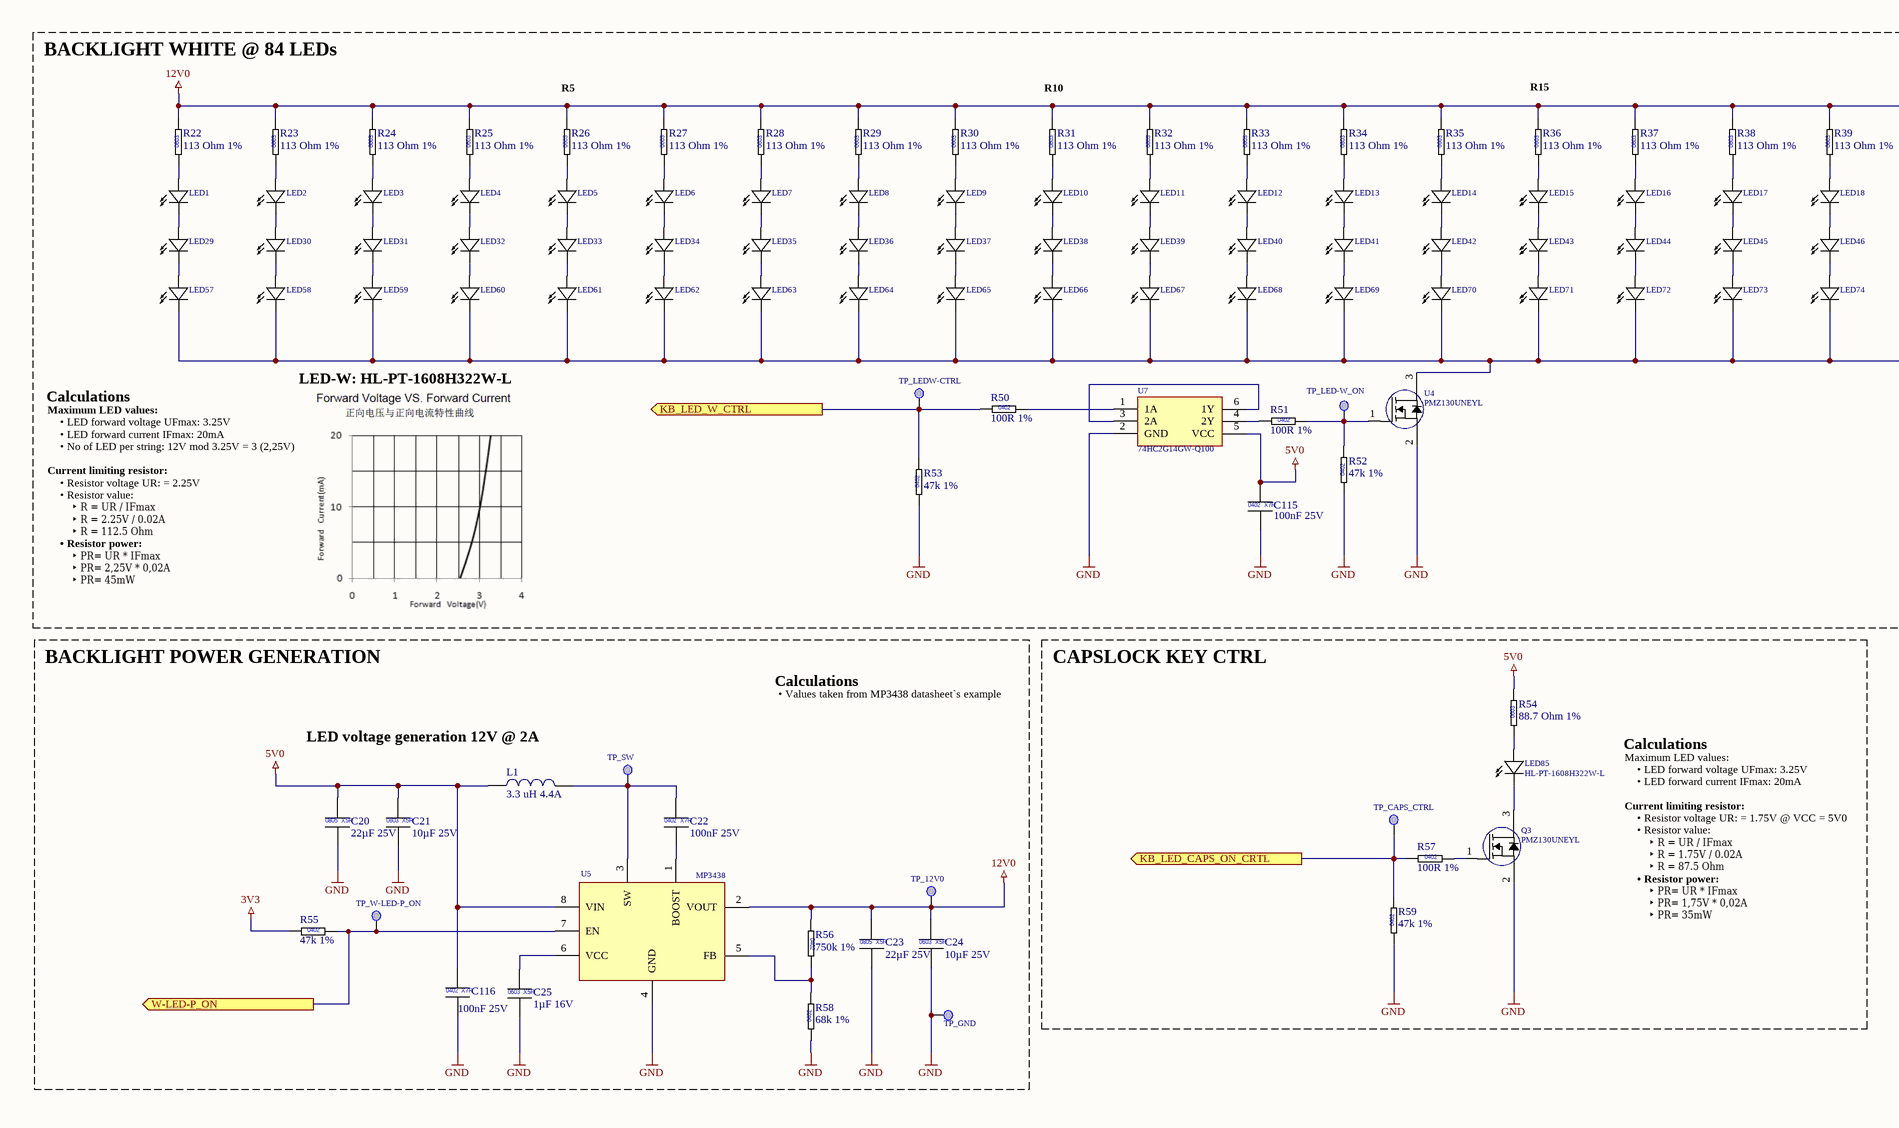
[diagram p7: backlight_W.SchDoc, left]
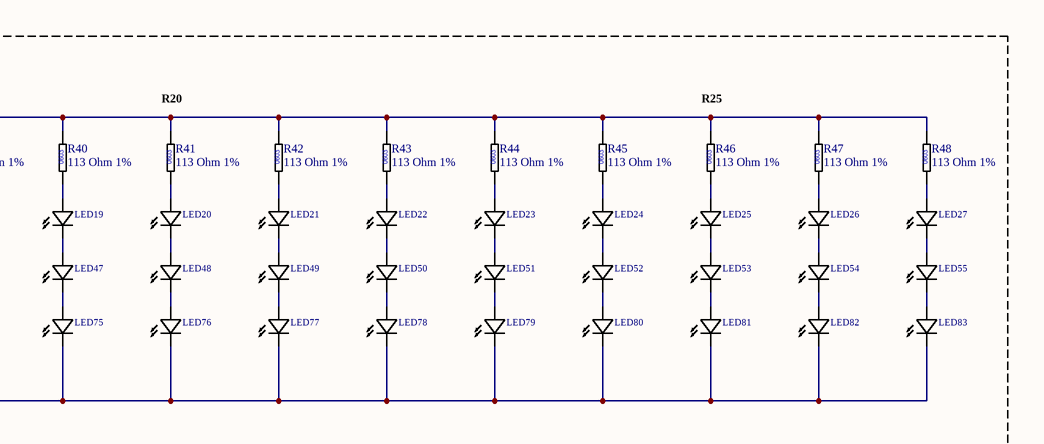
[diagram p8: backlight_W.SchDoc, right]

### Parts
(Parts that share a designator on the sheet are numbered #1, #2 ... from top to bottom, then left to right.)
?#4  (no value)  (graphical)
C20  22µF 25V  [CAPC2012X14L]
C21  10µF 25V  [CAPC1608X10L]
C22  100nF 25V  [CAPC1005X06L]
C23  22µF 25V  [CAPC2012X14L]
C24  10µF 25V  [CAPC1608X10L]
C25  1µF 16V  [CAPC1608X10L]
C115  100nF 25V  [CAPC1005X06L]
C116  100nF 25V  [CAPC1005X06L]
L1  3.3 uH 4.4A  [INDM4141X21N]
LED1  HL-PT-1608H322W-L  [LED 0603]  (value not drawn)
LED2  HL-PT-1608H322W-L  [LED 0603]  (value not drawn)
LED3  HL-PT-1608H322W-L  [LED 0603]  (value not drawn)
LED4  HL-PT-1608H322W-L  [LED 0603]  (value not drawn)
LED5  HL-PT-1608H322W-L  [LED 0603]  (value not drawn)
LED6  HL-PT-1608H322W-L  [LED 0603]  (value not drawn)
LED7  HL-PT-1608H322W-L  [LED 0603]  (value not drawn)
LED8  HL-PT-1608H322W-L  [LED 0603]  (value not drawn)
LED9  HL-PT-1608H322W-L  [LED 0603]  (value not drawn)
LED10  HL-PT-1608H322W-L  [LED 0603]  (value not drawn)
LED11  HL-PT-1608H322W-L  [LED 0603]  (value not drawn)
LED12  HL-PT-1608H322W-L  [LED 0603]  (value not drawn)
LED13  HL-PT-1608H322W-L  [LED 0603]  (value not drawn)
LED14  HL-PT-1608H322W-L  [LED 0603]  (value not drawn)
LED15  HL-PT-1608H322W-L  [LED 0603]  (value not drawn)
LED16  HL-PT-1608H322W-L  [LED 0603]  (value not drawn)
LED17  HL-PT-1608H322W-L  [LED 0603]  (value not drawn)
LED18  HL-PT-1608H322W-L  [LED 0603]  (value not drawn)
LED19  HL-PT-1608H322W-L  [LED 0603]  (value not drawn)
LED20  HL-PT-1608H322W-L  [LED 0603]  (value not drawn)
LED21  HL-PT-1608H322W-L  [LED 0603]  (value not drawn)
LED22  HL-PT-1608H322W-L  [LED 0603]  (value not drawn)
LED23  HL-PT-1608H322W-L  [LED 0603]  (value not drawn)
LED24  HL-PT-1608H322W-L  [LED 0603]  (value not drawn)
LED25  HL-PT-1608H322W-L  [LED 0603]  (value not drawn)
LED26  HL-PT-1608H322W-L  [LED 0603]  (value not drawn)
LED27  HL-PT-1608H322W-L  [LED 0603]  (value not drawn)
LED29  HL-PT-1608H322W-L  [LED 0603]  (value not drawn)
LED30  HL-PT-1608H322W-L  [LED 0603]  (value not drawn)
LED31  HL-PT-1608H322W-L  [LED 0603]  (value not drawn)
LED32  HL-PT-1608H322W-L  [LED 0603]  (value not drawn)
LED33  HL-PT-1608H322W-L  [LED 0603]  (value not drawn)
LED34  HL-PT-1608H322W-L  [LED 0603]  (value not drawn)
LED35  HL-PT-1608H322W-L  [LED 0603]  (value not drawn)
LED36  HL-PT-1608H322W-L  [LED 0603]  (value not drawn)
LED37  HL-PT-1608H322W-L  [LED 0603]  (value not drawn)
LED38  HL-PT-1608H322W-L  [LED 0603]  (value not drawn)
LED39  HL-PT-1608H322W-L  [LED 0603]  (value not drawn)
LED40  HL-PT-1608H322W-L  [LED 0603]  (value not drawn)
LED41  HL-PT-1608H322W-L  [LED 0603]  (value not drawn)
LED42  HL-PT-1608H322W-L  [LED 0603]  (value not drawn)
LED43  HL-PT-1608H322W-L  [LED 0603]  (value not drawn)
LED44  HL-PT-1608H322W-L  [LED 0603]  (value not drawn)
LED45  HL-PT-1608H322W-L  [LED 0603]  (value not drawn)
LED46  HL-PT-1608H322W-L  [LED 0603]  (value not drawn)
LED47  HL-PT-1608H322W-L  [LED 0603]  (value not drawn)
LED48  HL-PT-1608H322W-L  [LED 0603]  (value not drawn)
LED49  HL-PT-1608H322W-L  [LED 0603]  (value not drawn)
LED50  HL-PT-1608H322W-L  [LED 0603]  (value not drawn)
LED51  HL-PT-1608H322W-L  [LED 0603]  (value not drawn)
LED52  HL-PT-1608H322W-L  [LED 0603]  (value not drawn)
LED53  HL-PT-1608H322W-L  [LED 0603]  (value not drawn)
LED54  HL-PT-1608H322W-L  [LED 0603]  (value not drawn)
LED55  HL-PT-1608H322W-L  [LED 0603]  (value not drawn)
LED57  HL-PT-1608H322W-L  [LED 0603]  (value not drawn)
LED58  HL-PT-1608H322W-L  [LED 0603]  (value not drawn)
LED59  HL-PT-1608H322W-L  [LED 0603]  (value not drawn)
LED60  HL-PT-1608H322W-L  [LED 0603]  (value not drawn)
LED61  HL-PT-1608H322W-L  [LED 0603]  (value not drawn)
LED62  HL-PT-1608H322W-L  [LED 0603]  (value not drawn)
LED63  HL-PT-1608H322W-L  [LED 0603]  (value not drawn)
LED64  HL-PT-1608H322W-L  [LED 0603]  (value not drawn)
LED65  HL-PT-1608H322W-L  [LED 0603]  (value not drawn)
LED66  HL-PT-1608H322W-L  [LED 0603]  (value not drawn)
LED67  HL-PT-1608H322W-L  [LED 0603]  (value not drawn)
LED68  HL-PT-1608H322W-L  [LED 0603]  (value not drawn)
LED69  HL-PT-1608H322W-L  [LED 0603]  (value not drawn)
LED70  HL-PT-1608H322W-L  [LED 0603]  (value not drawn)
LED71  HL-PT-1608H322W-L  [LED 0603]  (value not drawn)
LED72  HL-PT-1608H322W-L  [LED 0603]  (value not drawn)
LED73  HL-PT-1608H322W-L  [LED 0603]  (value not drawn)
LED74  HL-PT-1608H322W-L  [LED 0603]  (value not drawn)
LED75  HL-PT-1608H322W-L  [LED 0603]  (value not drawn)
LED76  HL-PT-1608H322W-L  [LED 0603]  (value not drawn)
LED77  HL-PT-1608H322W-L  [LED 0603]  (value not drawn)
LED78  HL-PT-1608H322W-L  [LED 0603]  (value not drawn)
LED79  HL-PT-1608H322W-L  [LED 0603]  (value not drawn)
LED80  HL-PT-1608H322W-L  [LED 0603]  (value not drawn)
LED81  HL-PT-1608H322W-L  [LED 0603]  (value not drawn)
LED82  HL-PT-1608H322W-L  [LED 0603]  (value not drawn)
LED83  HL-PT-1608H322W-L  [LED 0603]  (value not drawn)
LED85  HL-PT-1608H322W-L  [LED 0603]
Q3  PMZ130UNEYL  [DFN65P98X50-3N]
R22  113 Ohm 1%  [RESC1608X04L]
R23  113 Ohm 1%  [RESC1608X04L]
R24  113 Ohm 1%  [RESC1608X04L]
R25  113 Ohm 1%  [RESC1608X04L]
R26  113 Ohm 1%  [RESC1608X04L]
R27  113 Ohm 1%  [RESC1608X04L]
R28  113 Ohm 1%  [RESC1608X04L]
R29  113 Ohm 1%  [RESC1608X04L]
R30  113 Ohm 1%  [RESC1608X04L]
R31  113 Ohm 1%  [RESC1608X04L]
R32  113 Ohm 1%  [RESC1608X04L]
R33  113 Ohm 1%  [RESC1608X04L]
R34  113 Ohm 1%  [RESC1608X04L]
R35  113 Ohm 1%  [RESC1608X04L]
R36  113 Ohm 1%  [RESC1608X04L]
R37  113 Ohm 1%  [RESC1608X04L]
R38  113 Ohm 1%  [RESC1608X04L]
R39  113 Ohm 1%  [RESC1608X04L]
R40  113 Ohm 1%  [RESC1608X04L]
R41  113 Ohm 1%  [RESC1608X04L]
R42  113 Ohm 1%  [RESC1608X04L]
R43  113 Ohm 1%  [RESC1608X04L]
R44  113 Ohm 1%  [RESC1608X04L]
R45  113 Ohm 1%  [RESC1608X04L]
R46  113 Ohm 1%  [RESC1608X04L]
R47  113 Ohm 1%  [RESC1608X04L]
R48  113 Ohm 1%  [RESC1608X04L]
R50  100R 1%  [RESC1005X04L]
R51  100R 1%  [RESC1005X04L]
R52  47k 1%  [RESC1005X04L]
R53  47k 1%  [RESC1005X04L]
R54  88.7 Ohm 1%  [RESC1608X04L]
R55  47k 1%  [RESC1005X04L]
R56  750k 1%  [RESC1005X04L]
R57  100R 1%  [RESC1005X04L]
R58  68k 1%  [RESC1005X04L]
R59  47k 1%  [RESC1005X04L]
TP_12V0  Testpoint 0.75mm  [TP_0.75mm]  (value not drawn)  (no BOM)
TP_CAPS_CTRL  Testpoint 0.75mm  [TP_0.75mm]  (value not drawn)  (no BOM)
TP_GND  Testpoint 0.75mm  [TP_0.75mm]  (value not drawn)  (no BOM)
TP_LED-W_ON  Testpoint 0.75mm  [TP_0.75mm]  (value not drawn)  (no BOM)
TP_LEDW-CTRL  Testpoint 0.75mm  [TP_0.75mm]  (value not drawn)  (no BOM)
TP_SW  Testpoint 0.75mm  [TP_0.75mm]  (value not drawn)  (no BOM)
TP_W-LED-P_ON  Testpoint 0.75mm  [TP_0.75mm]  (value not drawn)  (no BOM)
U4  PMZ130UNEYL  [DFN65P98X50-3N]
U5  MP3438  [SOT583]
U7  74HC2G14GW-Q100  [TSOP65P210X110-6N]

### Blocks framed on the sheet
BACKLIGHT WHITE @ 84 LEDs: C115 LED1-LED27 LED29-LED55 LED57-LED83 R22-R48 R50-R53 TP_LED-W_ON TP_LEDW-CTRL U4 U7
BACKLIGHT POWER GENERATION: C20-C25 C116 L1 R55 R56 R58 TP_12V0 TP_GND TP_SW TP_W-LED-P_ON U5
CAPSLOCK KEY CTRL: LED85 Q3 R54 R57 R59 TP_CAPS_CTRL

### Ports
KB_LED_CAPS_ON_CRTL (out), KB_LED_W_CTRL (out), W-LED-P_ON (out)

### Nets
3V3: R55.1
5V0: C20.1 C21.1 C115.1 C116.1 L1.1 R54.2 U5.8(VIN) U7.5(VCC)
12V0: C23.1 C24.1 R22.2 R23.2 R24.2 R25.2 R26.2 R27.2 R28.2 R29.2 R30.2 R31.2 R32.2 R33.2 R34.2 R35.2 R36.2 R37.2 R38.2 R39.2 R40.2 R41.2 R42.2 R43.2 R44.2 R45.2 R46.2 R47.2 R48.2 R56.1 TP_12V0.TP U5.2(VOUT)
GND: C20.2 C21.2 C23.2 C24.2 C25.2 C115.2 C116.2 Q3.2(S) R52.1 R53.1 R58.1 R59.1 TP_GND.TP U4.2(S) U5.4(GND) U7.2(GND)
NetC22_1: C22.1 L1.2 TP_SW.TP U5.3(SW)
NetC22_2: C22.2 U5.1(BOOST)
NetC25_1: C25.1 U5.6(VCC)
NetLED1_1: LED1.1 LED29.2
NetLED1_2: LED1.2 R22.1
NetLED2_1: LED2.1 LED30.2
NetLED2_2: LED2.2 R23.1
NetLED3_1: LED3.1 LED31.2
NetLED3_2: LED3.2 R24.1
NetLED4_1: LED4.1 LED32.2
NetLED4_2: LED4.2 R25.1
NetLED5_1: LED5.1 LED33.2
NetLED5_2: LED5.2 R26.1
NetLED6_1: LED6.1 LED34.2
NetLED6_2: LED6.2 R27.1
NetLED7_1: LED7.1 LED35.2
NetLED7_2: LED7.2 R28.1
NetLED8_1: LED8.1 LED36.2
NetLED8_2: LED8.2 R29.1
NetLED9_1: LED9.1 LED37.2
NetLED9_2: LED9.2 R30.1
NetLED10_1: LED10.1 LED38.2
NetLED10_2: LED10.2 R31.1
NetLED11_1: LED11.1 LED39.2
NetLED11_2: LED11.2 R32.1
NetLED12_1: LED12.1 LED40.2
NetLED12_2: LED12.2 R33.1
NetLED13_1: LED13.1 LED41.2
NetLED13_2: LED13.2 R34.1
NetLED14_1: LED14.1 LED42.2
NetLED14_2: LED14.2 R35.1
NetLED15_1: LED15.1 LED43.2
NetLED15_2: LED15.2 R36.1
NetLED16_1: LED16.1 LED44.2
NetLED16_2: LED16.2 R37.1
NetLED17_1: LED17.1 LED45.2
NetLED17_2: LED17.2 R38.1
NetLED18_1: LED18.1 LED46.2
NetLED18_2: LED18.2 R39.1
NetLED19_1: LED19.1 LED47.2
NetLED19_2: LED19.2 R40.1
NetLED20_1: LED20.1 LED48.2
NetLED20_2: LED20.2 R41.1
NetLED21_1: LED21.1 LED49.2
NetLED21_2: LED21.2 R42.1
NetLED22_1: LED22.1 LED50.2
NetLED22_2: LED22.2 R43.1
NetLED23_1: LED23.1 LED51.2
NetLED23_2: LED23.2 R44.1
NetLED24_1: LED24.1 LED52.2
NetLED24_2: LED24.2 R45.1
NetLED25_1: LED25.1 LED53.2
NetLED25_2: LED25.2 R46.1
NetLED26_1: LED26.1 LED54.2
NetLED26_2: LED26.2 R47.1
NetLED27_1: LED27.1 LED55.2
NetLED27_2: LED27.2 R48.1
NetLED29_1: LED29.1 LED57.2
NetLED30_1: LED30.1 LED58.2
NetLED31_1: LED31.1 LED59.2
NetLED32_1: LED32.1 LED60.2
NetLED33_1: LED33.1 LED61.2
NetLED34_1: LED34.1 LED62.2
NetLED35_1: LED35.1 LED63.2
NetLED36_1: LED36.1 LED64.2
NetLED37_1: LED37.1 LED65.2
NetLED38_1: LED38.1 LED66.2
NetLED39_1: LED39.1 LED67.2
NetLED40_1: LED40.1 LED68.2
NetLED41_1: LED41.1 LED69.2
NetLED42_1: LED42.1 LED70.2
NetLED43_1: LED43.1 LED71.2
NetLED44_1: LED44.1 LED72.2
NetLED45_1: LED45.1 LED73.2
NetLED46_1: LED46.1 LED74.2
NetLED47_1: LED47.1 LED75.2
NetLED48_1: LED48.1 LED76.2
NetLED49_1: LED49.1 LED77.2
NetLED50_1: LED50.1 LED78.2
NetLED51_1: LED51.1 LED79.2
NetLED52_1: LED52.1 LED80.2
NetLED53_1: LED53.1 LED81.2
NetLED54_1: LED54.1 LED82.2
NetLED55_1: LED55.1 LED83.2
NetLED57_1: LED57.1 LED58.1 LED59.1 LED60.1 LED61.1 LED62.1 LED63.1 LED64.1 LED65.1 LED66.1 LED67.1 LED68.1 LED69.1 LED70.1 LED71.1 LED72.1 LED73.1 LED74.1 LED75.1 LED76.1 LED77.1 LED78.1 LED79.1 LED80.1 LED81.1 LED82.1 LED83.1 U4.3(D)
NetLED85_1: LED85.1 Q3.3(D)
NetLED85_2: LED85.2 R54.1
NetQ3_1: Q3.1(G) R57.2
NetR50_1: R50.1 R53.2 TP_LEDW-CTRL.TP ; port KB_LED_W_CTRL
NetR50_2: R50.2 U7.1(1A)
NetR51_1: R51.1 U7.4(2Y)
NetR51_2: R51.2 R52.2 TP_LED-W_ON.TP U4.1(G)
NetR55_2: R55.2 TP_W-LED-P_ON.TP U5.7(EN) ; port W-LED-P_ON
NetR56_2: R56.2 R58.2 U5.5(FB)
NetR57_1: R57.1 R59.2 TP_CAPS_CTRL.TP ; port KB_LED_CAPS_ON_CRTL
NetU7_3: U7.3(2A) U7.6(1Y)

### Notes on the sheet
- (near R26) R5
- (near R31) R10
- (near R36) R15
- (near R41) R20
- (near R46) R25
- Calculations
- Maximum LED values:
- LED-W: HL-PT-1608H322W-L
- Current limiting resistor:
- • LED forward voltage UFmax: 3.25V
- • No of LED per string: 12V mod 3.25V = 3 (2,25V)
- • LED forward current IFmax: 20mA
- • Resistor voltage UR: = 2.25V
- • Resistor value:
- ‣ R = UR / IFmax
- ‣ R = 2.25V / 0.02A
- ‣ R = 112.5 Ohm
- • Resistor power:
- ‣ PR= UR * IFmax
- ‣ PR= 2,25V * 0,02A
- ‣ PR= 45mW
- • Values taken from MP3438 datasheet`s example
- (near L1) LED voltage generation 12V @ 2A
- • Resistor voltage UR: = 1.75V @ VCC = 5V0
- ‣ R = 1.75V / 0.02A
- ‣ R = 87.5 Ohm
- ‣ PR= 1,75V * 0,02A
- ‣ PR= 35mW
- © OV Tech GmbH - Open Visions Technology
- (in symbol CAP_0402_100nF_25V) 0402; X7R
- (in symbol CAP_0603_1µ_16V) 0603; X5R
- (in symbol CAP_0603_10µ_25V) 0603; X5R
- (in symbol CAP_0805_22µ_25V) 0805; X5R
- (in symbol RES_0402_47k_1%) 0402
- (in symbol RES_0402_68k_1%) 0402
- (in symbol RES_0402_100R_1%) 0402
- (in symbol RES_0402_750k_1%) 0402
- (in symbol RES_0603_88R7_1%_1) 0603
- (in symbol RES_0603_113R_1%) 0603

### Library data of the parts
?#4 = Titleblock_01
C20 C23 = CAP_0805_22µ_25V: Multilayer Ceramic Capacitors MLCC - SMD/SMT 0603 25VDC; Manufacturer 1: Murata Electronics; Manufacturer 1 Prt. Nr.: GRM21BR61E226ME44K; Manufacturer 2 Prt. Nr.: CC0805MKX5R8BB226; Manufacturer 2: YAGEO
C21 C24 = CAP_0603_10µ_25V: Multilayer Ceramic Capacitors MLCC - SMD/SMT 0603 25VDC; Manufacturer 1: Murata Electronics; Manufacturer 1 Prt. Nr.: GRM188R61E106KA73J; Manufacturer 2 Prt. Nr.: CL10A106MA8NRNC; Manufacturer 2: Samsung Electro-Mechanics
C22 C115 C116 = CAP_0402_100nF_25V: Multilayer Ceramic Capacitors MLCC - SMD/SMT 0402 25VDC; Manufacturer 1: KYOCERA AVX; Manufacturer 1 Prt. Nr.: KGM05AR71C104KH; Manufacturer 2 Prt. Nr.: EMK105B7104KV-F; Manufacturer 2: Taiyo Yuden
C25 = CAP_0603_1µ_16V: Multilayer Ceramic Capacitors MLCC - SMD/SMT 0603 16VDC; Manufacturer 1: Samsung Electro-Mechanics; Manufacturer 1 Prt. Nr.: CL05A105KO5NNNC; Manufacturer 2 Prt. Nr.: EMK105BJ105KV-F; Manufacturer 2: Taiyo Yuden
L1 = IND_MPL-AL4020-3R3_3.3uH_4.4A: Low-Resistance Molded Inductor 3.3μH; Manufacturer 1: MPS; Manufacturer 1 Prt. Nr.: MPL-AL4020-3R3
LED1-LED27 LED29-LED55 LED57-LED83 LED85 = LED White_HL-PT-1608H322W-L: 8000K~12000K 500mcd Yellow Diffused -40℃~+85℃ Positive post White light 130° 70mW 0603 Light Emitting Diodes (LED) ROHS; Manufacturer 1: HONGLITRONIC; Manufacturer 1 Prt. Nr.: HL-PT-1608H322W-L
Q3 U4 = N-Channel MOSFET_PMZ130UNEYL: MOSFET PMZ130UNE/SOT883/XQFN3; Manufacturer 1: Nexperia; Manufacturer 1 Prt. Nr.: PMZ130UNEYL
R22-R48 = RES_0603_113R_1%: Thick Film Resistors - SMD 113OHM 1%; Manufacturer 1: YAGEO; Manufacturer 1 Prt. Nr.: RC0603FR-07113RL; Manufacturer 2 Prt. Nr.: ERJ-3EKF1130V; Manufacturer 2: Panasonic Electronic Components
R50 R51 R57 = RES_0402_100R_1%: Thick Film Resistors - SMD 100R 1%; Manufacturer 1: Vishay / Dale; Manufacturer 1 Prt. Nr.: CRCW0402100RFKEDC; Manufacturer 2 Prt. Nr.: RC0402FR-07100RL; Manufacturer 2: YAGEO
R52 R53 R55 R59 = RES_0402_47k_1%: Thick Film Resistors - SMD 47k 1%; Manufacturer 1: Vishay / Dale; Manufacturer 1 Prt. Nr.: CRCW040247K0FKEDC; Manufacturer 2 Prt. Nr.: RT0402FRE0747KL; Manufacturer 2: YAGEO
R54 = RES_0603_88R7_1%_1: Thick Film Resistors - SMD 88.7OHM 1%; Manufacturer 1: Panasonic; Manufacturer 1 Prt. Nr.: ERJ-3EKF88R7V; Manufacturer 2 Prt. Nr.: CR0603-FX-88R7ELF; Manufacturer 2: Bourns
R56 = RES_0402_750k_1%: Thick Film Resistors - SMD 750k 1%; Manufacturer 1: Bourns; Manufacturer 1 Prt. Nr.: CR0402-FX-7503GLF; Manufacturer 2 Prt. Nr.: CRCW0402750KFKEDC; Manufacturer 2: Vishay / Dale
R58 = RES_0402_68k_1%: Thick Film Resistors - SMD 68k 1%; Manufacturer 1: Bourns; Manufacturer 1 Prt. Nr.: CR0402-FX-6802GLF; Manufacturer 2 Prt. Nr.: SFR01MZPJ683; Manufacturer 2: ROHM Semiconductor
U5 = Boost 2A, 16V_MP3438: 2A, 16V, High-Efficiency, Fully Integrated, Synchronous Boost Converter; Manufacturer 1: MPS; Manufacturer 1 Prt. Nr.: MP3438
U7 = Dual inverting Schmitt trigger 74HC2G14GW-Q100: Schmitt Trigger Inverter, 1I/P, 125Deg C Rohs Compliant: Yes |Nexperia 74HC2G14GW-Q100; Manufacturer 1: Nexperia; Manufacturer 1 Prt. Nr.: 74HC2G14GW-Q100

## Nets that join several sheets
3V3: Input_MCU (30 pins), backlight_W (R55.1)
5V0: Input_MCU (8 pins), backlight_RGB (6 pins), backlight_W (8 pins)
GND: Input_MCU (54 pins), Keymatrix_switches (21 pins), backlight_RGB (170 pins), backlight_W (16 pins)
NetR50_1: Input_MCU (U1.37), backlight_W (R50.1 R53.2 TP_LEDW-CTRL.TP)
NetR55_2: Input_MCU (U1.34), backlight_W (R55.2 TP_W-LED-P_ON.TP U5.7)
NetR57_1: Input_MCU (U1.36), backlight_W (R57.1 R59.2 TP_CAPS_CTRL.TP)
NetR60_2: Input_MCU (U1.35), backlight_RGB (R60.2 R168.2 TP_RGB_CTRL.TP)
NetR65_1: Input_MCU (U1.32), backlight_RGB (R65.1 R66.2 TP_RGB_P_CRTL.TP)
NetR147_2: Input_MCU (U1.2), Keymatrix_switches (R147.2)
NetR148_2: Input_MCU (U1.3), Keymatrix_switches (R148.2)
NetR149_2: Input_MCU (U1.4), Keymatrix_switches (R149.2)
NetR150_2: Input_MCU (U1.5), Keymatrix_switches (R150.2)
NetR151_2: Input_MCU (U1.6), Keymatrix_switches (R151.2)
NetR152_2: Input_MCU (U1.8), Keymatrix_switches (R152.2)
NetR153_2: Input_MCU (U1.9), Keymatrix_switches (R153.2)
NetR154_2: Input_MCU (U1.15), Keymatrix_switches (R154.2)
NetR155_2: Input_MCU (U1.17), Keymatrix_switches (R155.2)
NetR156_2: Input_MCU (U1.18), Keymatrix_switches (R156.2)
NetR157_2: Input_MCU (U1.27), Keymatrix_switches (R157.2)
NetR158_2: Input_MCU (U1.28), Keymatrix_switches (R158.2)
NetR159_2: Input_MCU (U1.29), Keymatrix_switches (R159.2)
NetR160_2: Input_MCU (U1.30), Keymatrix_switches (R160.2)
NetR161_2: Input_MCU (U1.31), Keymatrix_switches (R161.2)
S-ROW_0: Input_MCU (C114.1 R8.2 U1.12), Keymatrix_switches (R162.1)
S-ROW_1: Input_MCU (C112.1 R6.2 U1.16), Keymatrix_switches (R163.1)
S-ROW_2: Input_MCU (C113.1 R7.2 U1.11), Keymatrix_switches (R164.1)
S-ROW_3: Input_MCU (C111.1 R5.2 U1.14), Keymatrix_switches (R165.1)
S-ROW_4: Input_MCU (C110.1 R4.1 U1.13), Keymatrix_switches (R166.1)
S-ROW_5: Input_MCU (C19.1 R3.2 U1.7), Keymatrix_switches (R167.1)